# Altium schematic sheet interlinkP2A.SchDoc: Board-to-Board P2A
size Legal; CheckedBy: J. Brinton; CompanyName: Signal Laboratories, Inc.; DrawnBy: J. Brinton; Engineer: J. Brinton; Address1: 3479 Edison Way; Address2: Menlo Park CA 94025; Address3: +1 (877) 778-8435; Address4: siglabs.com; DocumentNumber: 44; Revision: 2b; SheetNumber: 45; SheetTotal: 58
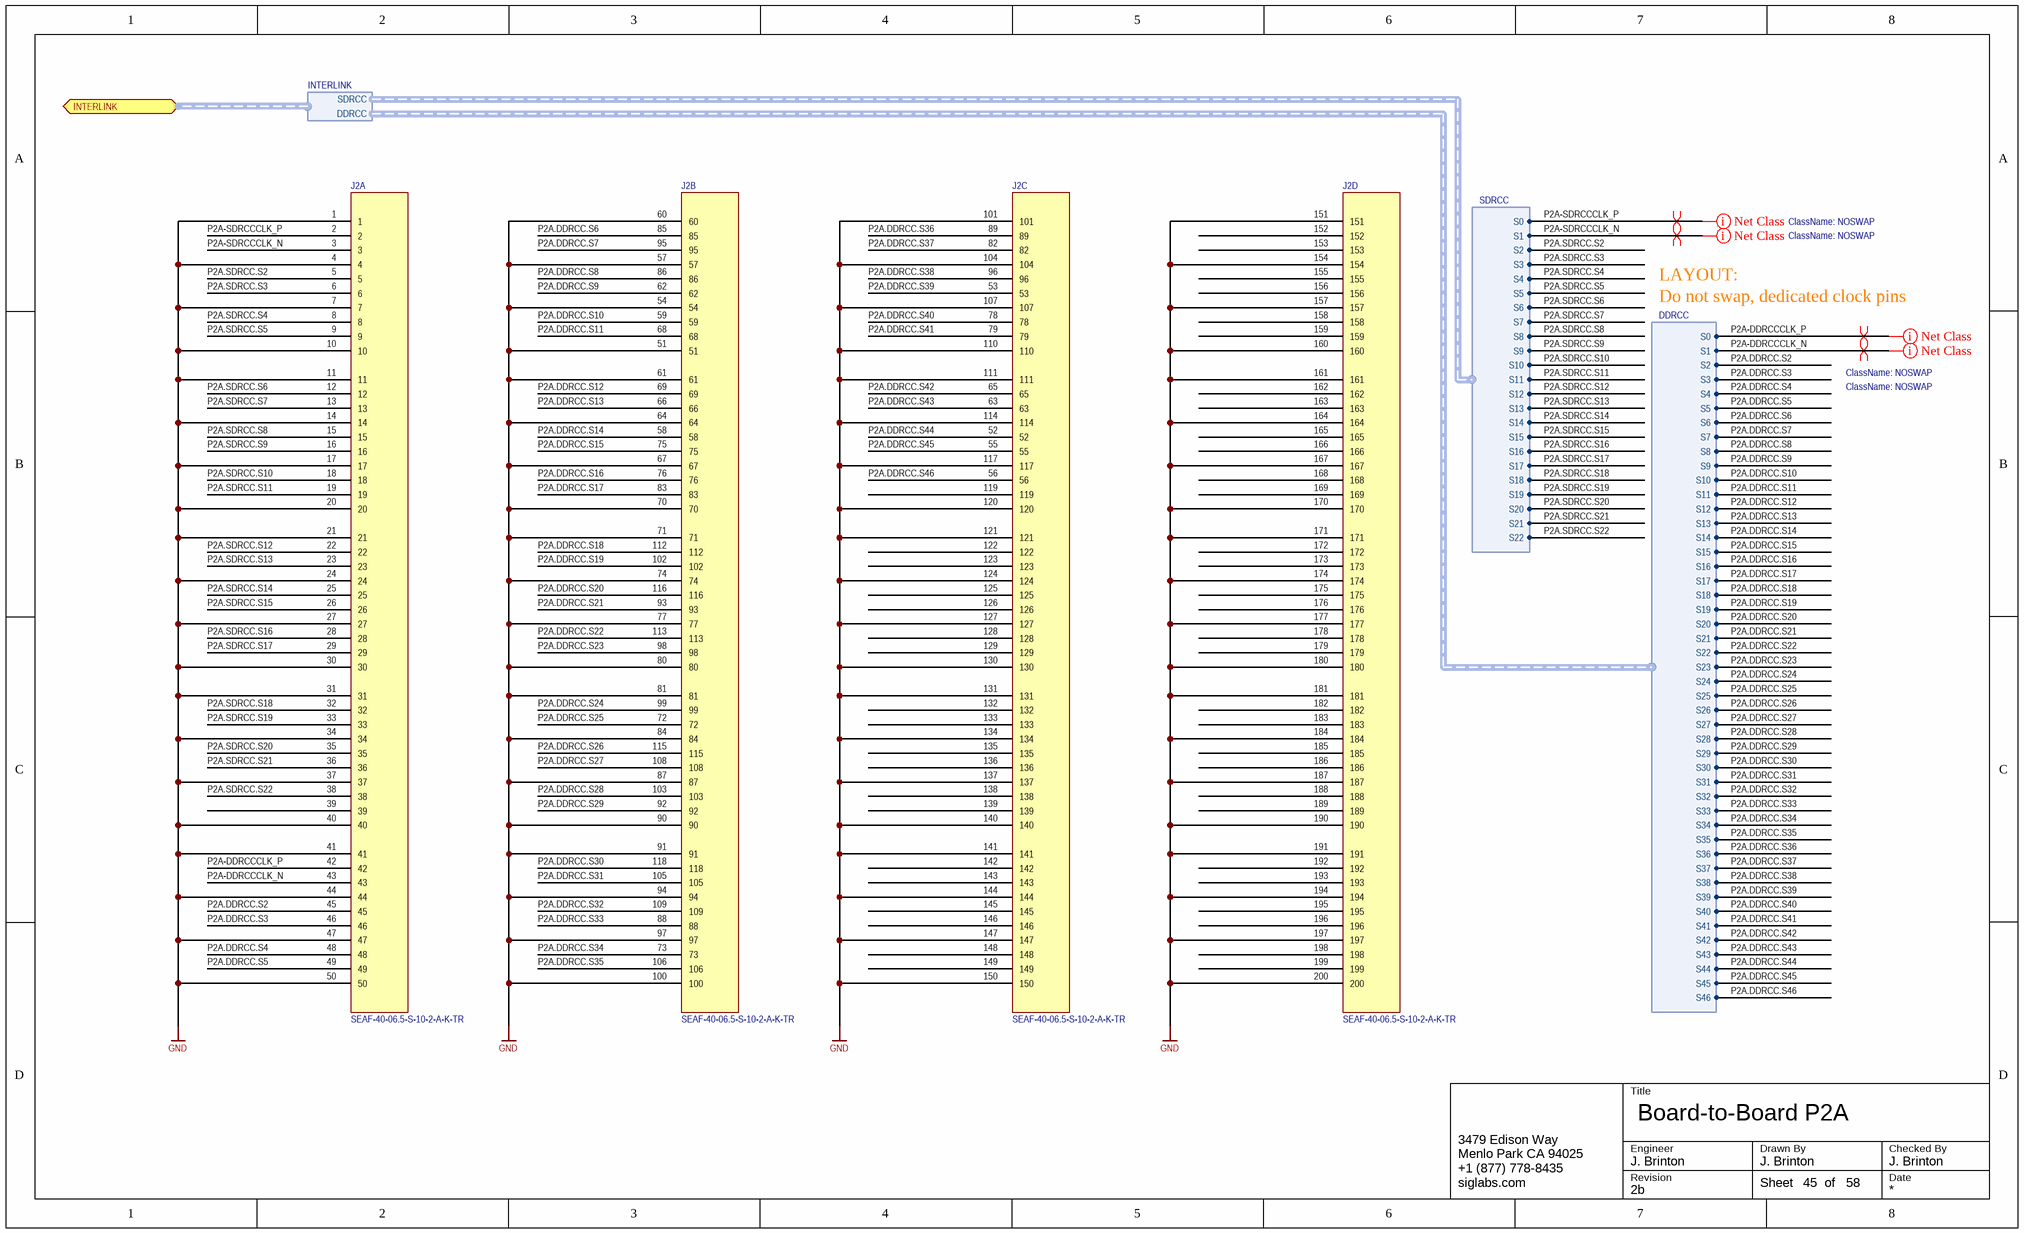
[diagram p0: interlinkP2A.SchDoc]

## Parts
J2  SEAF-40-06.5-S-10-2-A-K-TR  [SEAF-40-06.5-S-10-2-A-K-TR]  (parts A,B,C,D of 8)

## Ports
INTERLINK (harness INTERLINK)

## Harnesses
INTERLINK: DDRCC, SDRCC
DDRCC: S0, S1, S2, S3, S4, S5, S6, S7, S8, S9, S10, S11, S12, S13, S14, S15, S16, S17, S18, S19, S20, S21, S22, S23, S24, S25, S26, S27, S28, S29, S30, S31, S32, S33, S34, S35, S36, S37, S38, S39, S40, S41, S42, S43, S44, S45, S46
SDRCC: S0, S1, S2, S3, S4, S5, S6, S7, S8, S9, S10, S11, S12, S13, S14, S15, S16, S17, S18, S19, S20, S21, S22

## Nets
GND: J2.1 J2.4 J2.7 J2.10 J2.11 J2.14 J2.17 J2.20 J2.21 J2.24 J2.27 J2.30 J2.31 J2.34 J2.37 J2.40 J2.41 J2.44 J2.47 J2.50 J2.51 J2.54 J2.57 J2.60 J2.61 J2.64 J2.67 J2.70 J2.71 J2.74 J2.77 J2.80 J2.81 J2.84 J2.87 J2.90 J2.91 J2.94 J2.97 J2.100 J2.101 J2.104 J2.107 J2.110 J2.111 J2.114 J2.117 J2.120 J2.121 J2.124 J2.127 J2.130 J2.131 J2.134 J2.137 J2.140 J2.141 J2.144 J2.147 J2.150 J2.151 J2.154 J2.157 J2.160 J2.161 J2.164 J2.167 J2.170 J2.171 J2.174 J2.177 J2.180 J2.181 J2.184 J2.187 J2.190 J2.191 J2.194 J2.197 J2.200
P2A-DDRCCCLK_N: J2.43 ; harness DDRCC.S1
P2A-DDRCCCLK_P: J2.42 ; harness DDRCC.S0
P2A-SDRCCCLK_N: J2.3 ; harness SDRCC.S1
P2A-SDRCCCLK_P: J2.2 ; harness SDRCC.S0
P2A.DDRCC.S2: J2.45 ; harness DDRCC.S2
P2A.DDRCC.S3: J2.46 ; harness DDRCC.S3
P2A.DDRCC.S4: J2.48 ; harness DDRCC.S4
P2A.DDRCC.S5: J2.49 ; harness DDRCC.S5
P2A.DDRCC.S6: J2.85 ; harness DDRCC.S6
P2A.DDRCC.S7: J2.95 ; harness DDRCC.S7
P2A.DDRCC.S8: J2.86 ; harness DDRCC.S8
P2A.DDRCC.S9: J2.62 ; harness DDRCC.S9
P2A.DDRCC.S10: J2.59 ; harness DDRCC.S10
P2A.DDRCC.S11: J2.68 ; harness DDRCC.S11
P2A.DDRCC.S12: J2.69 ; harness DDRCC.S12
P2A.DDRCC.S13: J2.66 ; harness DDRCC.S13
P2A.DDRCC.S14: J2.58 ; harness DDRCC.S14
P2A.DDRCC.S15: J2.75 ; harness DDRCC.S15
P2A.DDRCC.S16: J2.76 ; harness DDRCC.S16
P2A.DDRCC.S17: J2.83 ; harness DDRCC.S17
P2A.DDRCC.S18: J2.112 ; harness DDRCC.S18
P2A.DDRCC.S19: J2.102 ; harness DDRCC.S19
P2A.DDRCC.S20: J2.116 ; harness DDRCC.S20
P2A.DDRCC.S21: J2.93 ; harness DDRCC.S21
P2A.DDRCC.S22: J2.113 ; harness DDRCC.S22
P2A.DDRCC.S23: J2.98 ; harness DDRCC.S23
P2A.DDRCC.S24: J2.99 ; harness DDRCC.S24
P2A.DDRCC.S25: J2.72 ; harness DDRCC.S25
P2A.DDRCC.S26: J2.115 ; harness DDRCC.S26
P2A.DDRCC.S27: J2.108 ; harness DDRCC.S27
P2A.DDRCC.S28: J2.103 ; harness DDRCC.S28
P2A.DDRCC.S29: J2.92 ; harness DDRCC.S29
P2A.DDRCC.S30: J2.118 ; harness DDRCC.S30
P2A.DDRCC.S31: J2.105 ; harness DDRCC.S31
P2A.DDRCC.S32: J2.109 ; harness DDRCC.S32
P2A.DDRCC.S33: J2.88 ; harness DDRCC.S33
P2A.DDRCC.S34: J2.73 ; harness DDRCC.S34
P2A.DDRCC.S35: J2.106 ; harness DDRCC.S35
P2A.DDRCC.S36: J2.89 ; harness DDRCC.S36
P2A.DDRCC.S37: J2.82 ; harness DDRCC.S37
P2A.DDRCC.S38: J2.96 ; harness DDRCC.S38
P2A.DDRCC.S39: J2.53 ; harness DDRCC.S39
P2A.DDRCC.S40: J2.78 ; harness DDRCC.S40
P2A.DDRCC.S41: J2.79 ; harness DDRCC.S41
P2A.DDRCC.S42: J2.65 ; harness DDRCC.S42
P2A.DDRCC.S43: J2.63 ; harness DDRCC.S43
P2A.DDRCC.S44: J2.52 ; harness DDRCC.S44
P2A.DDRCC.S45: J2.55 ; harness DDRCC.S45
P2A.DDRCC.S46: J2.56 ; harness DDRCC.S46
P2A.SDRCC.S2: J2.5 ; harness SDRCC.S2
P2A.SDRCC.S3: J2.6 ; harness SDRCC.S3
P2A.SDRCC.S4: J2.8 ; harness SDRCC.S4
P2A.SDRCC.S5: J2.9 ; harness SDRCC.S5
P2A.SDRCC.S6: J2.12 ; harness SDRCC.S6
P2A.SDRCC.S7: J2.13 ; harness SDRCC.S7
P2A.SDRCC.S8: J2.15 ; harness SDRCC.S8
P2A.SDRCC.S9: J2.16 ; harness SDRCC.S9
P2A.SDRCC.S10: J2.18 ; harness SDRCC.S10
P2A.SDRCC.S11: J2.19 ; harness SDRCC.S11
P2A.SDRCC.S12: J2.22 ; harness SDRCC.S12
P2A.SDRCC.S13: J2.23 ; harness SDRCC.S13
P2A.SDRCC.S14: J2.25 ; harness SDRCC.S14
P2A.SDRCC.S15: J2.26 ; harness SDRCC.S15
P2A.SDRCC.S16: J2.28 ; harness SDRCC.S16
P2A.SDRCC.S17: J2.29 ; harness SDRCC.S17
P2A.SDRCC.S18: J2.32 ; harness SDRCC.S18
P2A.SDRCC.S19: J2.33 ; harness SDRCC.S19
P2A.SDRCC.S20: J2.35 ; harness SDRCC.S20
P2A.SDRCC.S21: J2.36 ; harness SDRCC.S21
P2A.SDRCC.S22: J2.38 ; harness SDRCC.S22

Not connected (* = marked no-connect by the designer): J2 39 119 122 123 125 126 128 129 132 133 135 136 138 139 142 143 145 146 148 149 152 153 155 156 158 159 162 163 165 166 168 169 172 173 175 176 178 179 182 183 185 186 188 189 192 193 195 196 198 199

## Layout directives
net class NOSWAP: P2A-DDRCCCLK_N, P2A-DDRCCCLK_P, P2A-SDRCCCLK_N, P2A-SDRCCCLK_P
differential pair: P2A-DDRCCCLK_N, P2A-DDRCCCLK_P, P2A-SDRCCCLK_N, P2A-SDRCCCLK_P

## Notes on the sheet
- Do not swap, dedicated clock pins
- LAYOUT:
- Title
- Engineer
- Revision
- Drawn By
- Checked By
- Date
- Sheet
- of

## Library data of the parts
J2 = SEAF-40-06.5-S-10-2-A-K-TR: Terminal Array Assembly, Surface Mount, 0.050" Pitch, 400 Pins; Manufacturer: Samtec; Manufacturer P/N: SEAF-40-06.5-S-10-2-A-K-TR